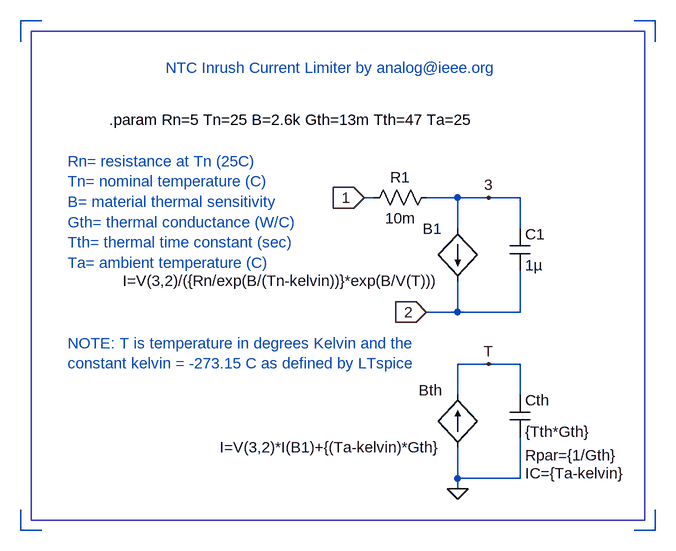
[diagram p0: schematic ntc.asc]
ntc.asc, the LTspice schematic file:
Version 4
SHEET 1 944 680
WIRE 208 -32 208 16
WIRE 208 16 304 16
WIRE 304 16 304 -48
WIRE 304 -112 304 -160
WIRE 304 -160 256 -160
WIRE 208 -160 208 -112
WIRE 64 -416 80 -416
WIRE 208 -416 208 -368
WIRE 208 -288 208 -240
WIRE 208 -240 160 -240
WIRE 208 32 208 16
WIRE 256 -160 208 -160
WIRE 208 -416 256 -416
WIRE 304 -416 304 -368
WIRE 304 -304 304 -240
WIRE 304 -240 208 -240
WIRE 160 -416 208 -416
WIRE 256 -416 304 -416
WIRE -464 -688 -464 -656
WIRE -464 -688 -432 -688
WIRE 512 -688 512 -656
WIRE 512 -688 480 -688
WIRE -464 96 -464 64
WIRE -464 96 -432 96
WIRE 512 96 512 64
WIRE 512 96 480 96
FLAG 64 -416 1
IOPIN 64 -416 In
FLAG 160 -240 2
IOPIN 160 -240 In
FLAG 208 32 0
FLAG 256 -160 T
FLAG 256 -416 3
SYMBOL bi 208 -368 M0
SYMATTR InstName B1
SYMATTR Value I=V(3,2)/({Rn/exp(B/(Tn-kelvin))}*exp(B/V(T)))
SYMBOL bi 208 -32 R180
WINDOW 0 24 88 Left 0
WINDOW 3 24 0 Left 0
SYMATTR InstName Bth
SYMATTR Value I=V(3,2)*I(B1)+{(Ta-kelvin)*Gth}
SYMBOL cap 288 -112 R0
WINDOW 39 24 92 Left 0
WINDOW 123 24 120 Left 0
SYMATTR SpiceLine Rpar={1/Gth}
SYMATTR Value2 IC={Ta-kelvin}
SYMATTR InstName Cth
SYMATTR Value {Tth*Gth}
SYMBOL cap 288 -368 R0
SYMATTR InstName C1
SYMATTR Value 1µ
SYMATTR SpiceLine Rpar=1e7
SYMBOL res 176 -432 R90
WINDOW 0 0 56 VBottom 0
WINDOW 3 32 56 VTop 0
SYMATTR InstName R1
SYMATTR Value 10m
TEXT -328 -536 Left 0 !.param Rn=5 Tn=25 B=2.6k Gth=13m Tth=47 Ta=25
TEXT -392 -472 Left 0 ;Rn= resistance at Tn (25C)\nTn= nominal temperature (C)\nB= material thermal sensitivity\nGth= thermal conductance (W/C)\nTth= thermal time constant (sec)\nTa= ambient temperature (C)
TEXT -392 -192 Left 0 ;NOTE: T is temperature in degrees Kelvin and the\nconstant kelvin = -273.15 C as defined by LTspice
TEXT 16 -616 Center 0 ;NTC Inrush Current Limiter by analog@ieee.org
RECTANGLE Normal 496 80 -448 -672

The netlist it stands for:
* ntc.asc
B1 3 2 I=V(3,2)/({Rn/exp(B/(Tn-kelvin))}*exp(B/V(T)))
Bth 0 T I=V(3,2)*I(B1)+{(Ta-kelvin)*Gth}
Cth T 0 {Tth*Gth} IC={Ta-kelvin} Rpar={1/Gth}
C1 3 2 1µ Rpar=1e7
R1 3 1 10m
.param Rn=5 Tn=25 B=2.6k Gth=13m Tth=47 Ta=25
* Rn= resistance at Tn (25C)
* Tn= nominal temperature (C)
* B= material thermal sensitivity
* Gth= thermal conductance (W/C)
* Tth= thermal time constant (sec)
* Ta= ambient temperature (C)
* NOTE: T is temperature in degrees Kelvin and the
* constant kelvin = -273.15 C as defined by LTspice
* NTC Inrush Current Limiter by analog@ieee.org
.backanno
.end